# EAGLE design motor_breakout (EAGLE 7.2.0)
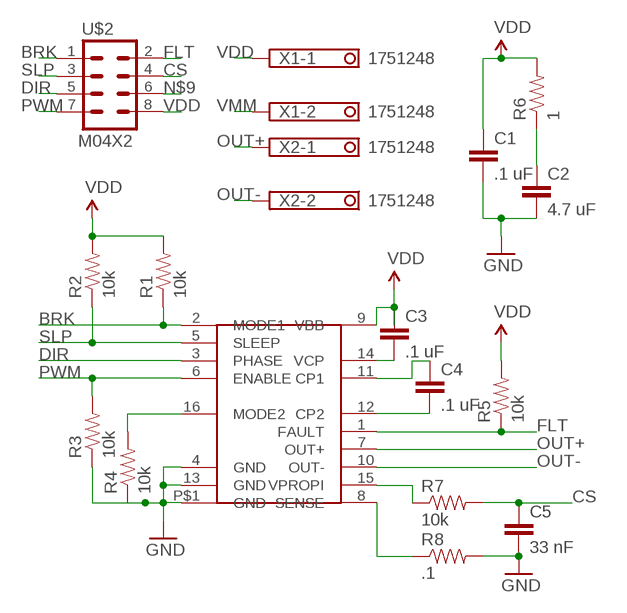
[diagram p0: schematic, sheet 1]

## Parts
C1  .1 uF  CAPPTH  [CAP-PTH-SMALL]
C2  4.7 uF  CAPPTH  [CAP-PTH-SMALL]
C3  .1 uF  CAPPTH  [CAP-PTH-SMALL]
C4  .1 uF  CAPPTH  [CAP-PTH-SMALL]
C5  33 nF  CAPPTH  [CAP-PTH-SMALL]
R1  10k  RESISTOR0603  [0603-RES]
R2  10k  RESISTOR0603  [0603-RES]
R3  10k  RESISTOR0603  [0603-RES]
R4  10k  RESISTOR0603  [0603-RES]
R5  10k  RESISTOR0603  [0603-RES]
R6  1  RESISTOR0603  [0603-RES]
R7  10k  RESISTOR0603  [0603-RES]
R8  .1  RESISTOR0603  [0603-RES]
U$1  DRV8801PWP  [TSSOP16]
U$2  M04X2  [2X4]
X1  1751248  [1751248]
X2  1751248  [1751248]

## Nets
BRK: R1.1 U$1.2(MODE1) U$2.1
CS: C5.1 R7.2 U$2.4
DIR: U$1.3(PHASE) U$2.5
FLT: R5.1 U$1.1(FAULT) U$2.2
GND: C1.2 C2.2 C5.2 R3.1 R4.1 R8.2 U$1.4(GND) U$1.13(GND) U$1.P$1(GND)
N$1: R4.2 U$1.16(MODE2)
N$2: R8.1 U$1.8(SENSE)
N$9: U$2.6
N$16: R7.1 U$1.15(VPROPI)
N$18: C3.2 U$1.14(VCP)
N$19: C4.1 U$1.11(CP1)
N$20: C4.2 U$1.12(CP2)
N$22: C2.1 R6.1
OUT+: U$1.7(OUT+) X2.1
OUT-: U$1.10(OUT-) X2.2
PWM: R3.2 U$1.6(ENABLE) U$2.7
SLP: R2.1 U$1.5(SLEEP) U$2.3
VDD: C1.1 C3.1 R1.2 R2.2 R5.2 R6.2 U$1.9(VBB) U$2.8 X1.1
VMM: X1.2

## Library data of the parts
C1-C5 = SparkFun-Capacitors:CAP: Capacitor Standard 0603 ceramic capacitor, and 0.1" leaded capacitor.
R1-R8 = SparkFun-Resistors:RESISTOR: Resistor Basic schematic elements and footprints for 0603, 1206, and PTH resistors.
U$1 = neptune:DRV8801PWP
U$2 = SparkFun-Connectors:M04X2: .1" header, two rows of four.
X1 X2 = con-phoenix-350:1751248: MKDS 1/ 2-3,5 Printklemme Nennstrom: 10 A Bemessungsspannung: 160 V Raster: 3,5 mm Polzahl: 2 Montageart: Löten Anschlussart: Schraubanschluss Anschlussrichtung vom Leiter zur Platine: 0° Source: http://eshop.phoenixcontact.com .. 1751248.pdf; OC_FARNELL: unknown; OC_NEWARK: unknown

## Board
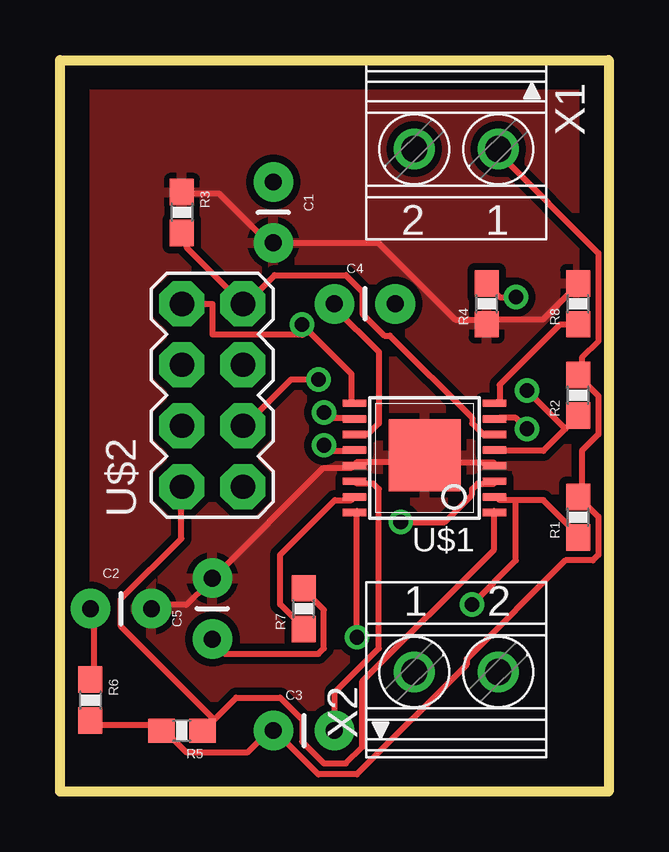
[diagram p1: board, top side]
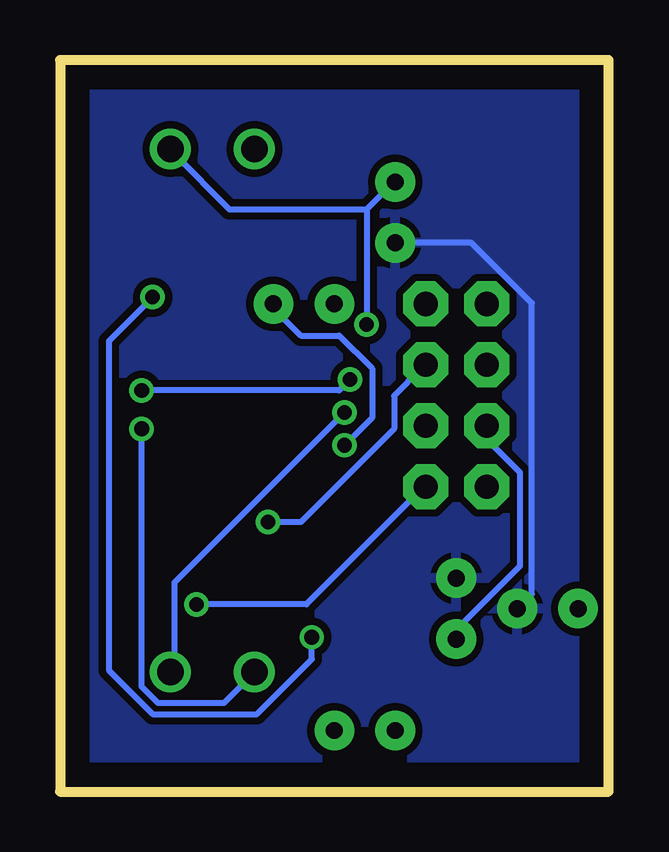
[diagram p2: board, bottom side, seen from below]

Size 22.86 x 30.48 mm. Coordinates in mm from the lower left corner, seen from the top.
Outline: 0,0 0,30.48 22.86,30.48 22.86,0 0,0
Copper layers (1*16): Top 0.035mm / dielectric 1.5mm / Bottom 0.035mm
Design rules "default": minimum track width 10mil, minimum drill 24mil, track to track 8mil, track to pad 8mil, pad to pad 8mil, via to via 8mil, smd to smd 8mil, copper to edge 40mil, drill to drill 8mil, minimum pad ring 10mil, minimum via ring 8mil, stop-mask expansion 4mil, vias tented up to drill 0mil, thermal gap 10mil

### Footprints (pad centres in the part's own frame; a part is rotated, then mirrored left to right if it is on the bottom)
CAP-PTH-SMALL = drill 0.7 pad 1.651: 1 0,0; 2 2.54,0
0603-RES = smd 1.1 x 1: 1 -0.85,0; 2 0.85,0
TSSOP16 = smd 0.305 x 0.991: 1 -2.345,-2.868; 2 -1.695,-2.868; 3 -1.045,-2.868; 4 -0.395,-2.868; 5 0.255,-2.868; 6 0.905,-2.868; 7 1.555,-2.868; 8 2.205,-2.868; 9 2.205,2.968; 10 1.555,2.968; 11 0.905,2.968; 12 0.255,2.968; 13 -0.395,2.968; 14 -1.045,2.968; 15 -1.695,2.968; 16 -2.345,2.968 | smd 3 x 3: P$1 0.05,0.05
2X4 = drill 1.016 pad 1.88 octagon: 1 -3.81,-1.27; 2 -3.81,1.27; 3 -1.27,-1.27; 4 -1.27,1.27; 5 1.27,-1.27; 6 1.27,1.27; 7 3.81,-1.27; 8 3.81,1.27
1751248 = drill 1.1 pad 1.7: 1 -1.75,-0.1; 2 1.75,-0.1

### Placement (x,y rotation side)
C1  8.89,25.4 270 top
C2  1.27,7.62 0 top
C3  8.89,2.54 0 top
C4  11.43,20.32 0 top
C5  6.35,6.35 90 top
R1  21.59,11.43 90 top
R2  21.59,16.51 90 top
R3  5.08,24.13 270 top
R4  17.78,20.32 90 top
R5  5.08,2.54 180 top
R6  1.27,3.81 270 top
R7  10.16,7.62 90 top
R8  21.59,20.32 90 top
U$1  15.24,13.97 90 top
U$2  6.35,16.51 90 top
X1  16.51,26.67 180 top
X2  16.51,5.08 0 top

### Tracks (layer width: path | path; a pad name or v marks a point on that pad's centre or on a via)
BRK  (via drill 0.61)
  Top 0.254: 19,12.14 20.14,12.14 21.51,10.77 R1.1 | 19,12.14 18.31,12.14 U$1.2 | 19,12.14 19,9.63 v17.17,7.8
  Bottom 0.254: v17.17,7.8 12.6,7.8 7.8,12.6 U$2.1
CS
  Top 0.254: R7.2 10.31,8.26 11,7.57 11,5.97 10.77,5.74 6.88,5.74 6.43,6.2 C5.1
  Bottom 0.254: U$2.4 5.05,15.11 5.05,14.66 3.68,13.28 3.68,9.4 6.2,6.88 6.2,6.43 C5.1
DIR  (via drill 0.61)
  Top 0.254: v14.2,11.23 16.03,11.23 17.17,12.37 17.17,12.6 17.4,12.83 18.09,12.83 U$1.3
  Bottom 0.254: v14.2,11.23 12.83,11.23 8.94,15.11 8.94,16.48 7.8,17.63 U$2.5
FLT
  Top 0.254: 6.43,3 5.97,2.54 R5.1 6.43,3 | 6.43,3 7.34,3.91 9.17,3.91 10.08,3 10.08,2.08 11,1.17 11.91,1.17 12.6,1.85 12.6,4.6 18.09,10.08 18.09,11.68 U$1.1 | 6.43,3 2.54,6.88 2.54,8.03 5.05,10.54 5.05,12.6 U$2.2
GND
  Top 0.254: R8.2 21.49,21.03 20.12,19.66 17.83,19.66 R4.1 17.6,19.66 16.46,19.66 13.26,22.86 C1.2 8.69,22.86 6.63,24.92 5.26,24.92 R3.1 | U$1.4 18.06,13.72 15.54,13.72 15.32,13.95 U$1.P$1 15.09,13.95 14.86,13.72 12.34,13.72 U$1.13 12.12,13.49 10.97,13.49 6.4,8.91 C5.2 6.17,8.69 5.26,7.77 3.89,7.77 C2.2
  Bottom 0.254: C1.2 5.71,22.86 3.2,20.34 3.2,8.23 C2.2
  pour Top (isolate 0.305): 0,0 0,30.48 22.86,30.48 22.86,0
  pour Bottom (isolate 0.305): 0,0 0,30.48 22.86,30.48 22.86,0
N$1  (via drill 0.61)
  Top 0.254: v12.37,6.43 12.37,11.68 U$1.16 | v19,20.6 18.31,20.6 17.86,21.06 R4.2
  Bottom 0.254: v12.37,6.43 12.37,5.51 14.66,3.23 19,3.23 20.83,5.05 20.83,18.77 v19,20.6
N$2
  Top 0.254: U$1.8 18.31,16.26 18.31,16.94 20.83,19.46 21.51,19.46 R8.1
N$16
  Top 0.254: U$1.15 12.14,12.14 11.46,12.14 9.17,9.86 9.17,7.8 10.08,6.88 R7.1
N$18
  Top 0.254: U$1.14 12.37,12.83 13.06,12.83 13.28,12.6 13.28,5.97 11.46,4.14 11.46,2.54 C3.2
N$19
  Top 0.254: U$1.11 12.37,14.88 12.83,14.88 13.28,15.34 13.28,18.31 11.46,20.14 C4.1
N$20  (via drill 0.61)
  Top 0.254: v11,14.43 11.23,14.2 12.14,14.2 U$1.12
  Bottom 0.254: v11,14.43 9.86,15.57 9.86,17.63 11.23,19 12.83,19 13.97,20.14 C4.2
N$22
  Top 0.254: R6.1 1.4,4.83 1.4,7.57 C2.1
OUT+  (via drill 0.61)
  Top 0.254: v19.46,15.11 19,15.57 18.31,15.57 U$1.7
  Bottom 0.254: v19.46,15.11 19.46,4.37 18.77,3.68 16.03,3.68 14.88,4.83 X2.1
OUT-  (via drill 0.61)
  Top 0.254: v11,15.8 11.23,15.57 12.14,15.57 U$1.10
  Bottom 0.254: v11,15.8 18.09,8.71 18.09,5.05 X2.2
PWM
  Top 0.254: U$1.6 18.09,14.88 17.63,14.88 17.17,15.34 17.17,15.57 13.74,19 13.51,19 12.6,19.91 12.6,20.83 11.91,21.51 8.94,21.51 7.8,20.37 U$2.7 5.28,22.66 5.28,23.11 R3.2
SLP  (via drill 0.61)
  Top 0.254: 21.06,15.11 21.51,15.57 R2.1 | 21.06,15.11 20.14,14.2 18.31,14.2 U$1.5 | v19.46,16.71 21.06,15.11 | v10.77,17.17 9.63,17.17 7.8,15.34 U$2.3
  Bottom 0.254: v19.46,16.71 11.23,16.71 v10.77,17.17
VDD  (via drill 0.61)
  Top 0.254: v10.08,19.46 12.14,17.4 12.14,16.26 U$1.9 | R6.2 1.4,2.77 3.91,2.77 4.14,2.54 R5.2 4.37,2.54 5.28,1.63 7.8,1.63 8.71,2.54 C3.1 8.94,2.54 10.77,0.71 12.37,0.71 16.94,5.28 16.94,5.51 21.06,9.63 22.2,9.63 22.43,9.86 22.43,11.46 21.74,12.14 R1.2 21.74,12.37 21.74,14.2 22.43,14.88 22.43,16.48 21.74,17.17 R2.2 21.74,17.4 21.74,18.09 22.43,18.77 22.43,22.43 18.31,26.54 X1.1 | U$2.8 6.35,20.32 6.35,19.05 10.08,19.05
  Top 0.305: 10.08,19.05 v10.08,19.46
  Bottom 0.254: 10.08,24.26 v10.08,19.46 | 10.08,24.26 8.94,25.4 C1.1 | 10.08,24.26 15.8,24.26 18.09,26.54 X1.1